# Altium schematic sheet HeartSound_LungSound.SchDoc
size A3; SheetNumber: 2; SheetTotal: 7
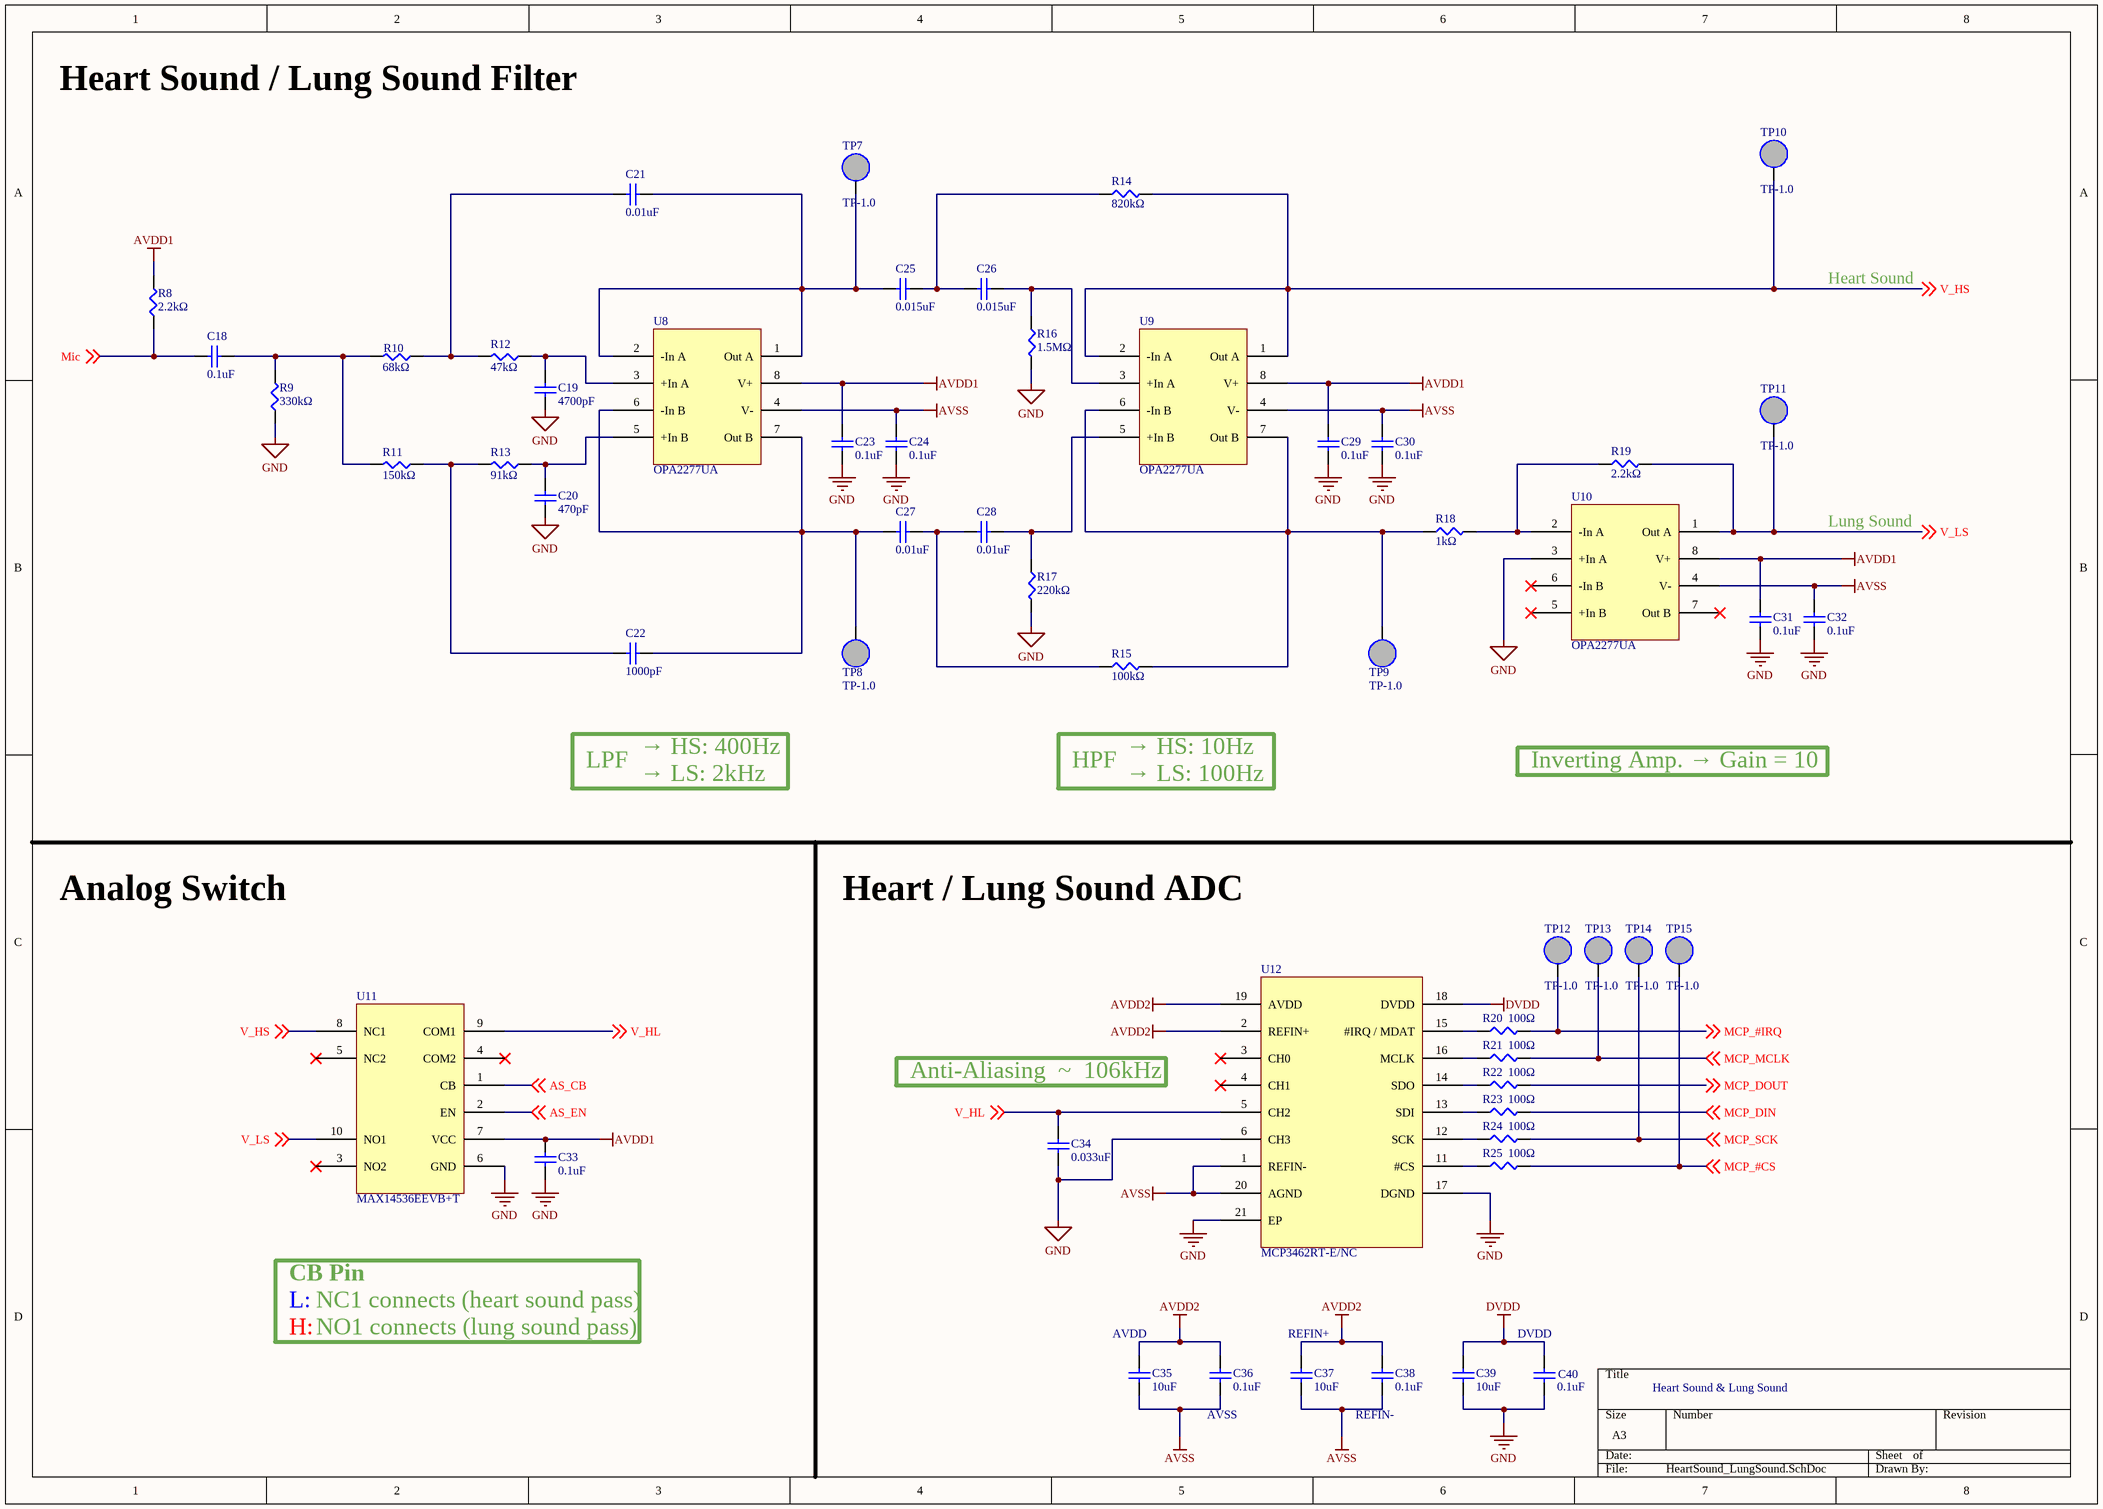
[diagram p0: HeartSound_LungSound.SchDoc]

## Parts
C18  0.1uF  [0402]
C19  4700pF  [0402]
C20  470pF  [0402]
C21  0.01uF  [0402]
C22  1000pF  [0402]
C23  0.1uF  [0402]
C24  0.1uF  [0402]
C25  0.015uF  [0402]
C26  0.015uF  [0402]
C27  0.01uF  [0402]
C28  0.01uF  [0402]
C29  0.1uF  [0402]
C30  0.1uF  [0402]
C31  0.1uF  [0402]
C32  0.1uF  [0402]
C33  0.1uF  [0402]
C34  0.033uF  [0402]
C35  10uF  [0603]
C36  0.1uF  [0402]
C37  10uF  [0603]
C38  0.1uF  [0402]
C39  10uF  [0603]
C40  0.1uF  [0402]
R8  2.2kΩ  [0402]
R9  330kΩ  [0402]
R10  68kΩ  [0402]
R11  150kΩ  [0402]
R12  47kΩ  [0402]
R13  91kΩ  [0402]
R14  820kΩ  [0402]
R15  100kΩ  [0402]
R16  1.5MΩ  [0402]
R17  220kΩ  [0402]
R18  1kΩ  [0402]
R19  2.2kΩ  [0402]
R20  100Ω  [0402]
R21  100Ω  [0402]
R22  100Ω  [0402]
R23  100Ω  [0402]
R24  100Ω  [0402]
R25  100Ω  [0402]
TP7  TP-1.0  [Testpoint]  (no BOM)
TP8  TP-1.0  [Testpoint]  (no BOM)
TP9  TP-1.0  [Testpoint]  (no BOM)
TP10  TP-1.0  [Testpoint]  (no BOM)
TP11  TP-1.0  [Testpoint]  (no BOM)
TP12  TP-1.0  [Testpoint]  (no BOM)
TP13  TP-1.0  [Testpoint]  (no BOM)
TP14  TP-1.0  [Testpoint]  (no BOM)
TP15  TP-1.0  [Testpoint]  (no BOM)
U8  OPA2277UA  [SOIC-8]
U9  OPA2277UA  [SOIC-8]
U10  OPA2277UA  [SOIC-8]
U11  MAX14536EEVB+T  [ULTRA-TQFN-10]
U12  MCP3462RT-E/NC  [UQFN-20]

## Nets
AVDD1: C23.1 C29.2 C31.2 C33.2 R8.2 U8.8(V+) U9.8(V+) U10.8(V+) U11.7(VCC)
AVDD2: C35.2 C36.2 C37.1 C38.2 U12.2(REFIN+) U12.19(AVDD)
AVSS: C24.2 C30.1 C32.1 C35.1 C36.1 C37.2 C38.1 U8.4(V-) U9.4(V-) U10.4(V-) U12.1(REFIN-) U12.20(AGND)
DVDD: C39.2 C40.2 U12.18(DVDD)
GND: C19.2 C20.2 C23.2 C24.1 C29.1 C30.2 C31.1 C32.2 C33.1 C34.2 C39.1 C40.1 R9.1 R16.2 R17.2 U10.3(+In_A) U11.6(GND) U12.6(CH3) U12.17(DGND) U12.21(EP)
AS_CB: U11.1(CB) ; off-sheet AS_CB
AS_EN: U11.2(EN) ; off-sheet AS_EN
MCP_#CS: R25.2 TP15.1 ; off-sheet MCP_#CS
MCP_#IRQ: R20.2 TP12.1 ; off-sheet MCP_#IRQ
MCP_DIN: R23.2 ; off-sheet MCP_DIN
MCP_DOUT: R22.2 ; off-sheet MCP_DOUT
MCP_MCLK: R21.2 TP13.1 ; off-sheet MCP_MCLK
MCP_SCK: R24.2 TP14.1 ; off-sheet MCP_SCK
Mic: C18.1 R8.1 ; off-sheet Mic
V_HL: C34.1 U11.9(COM1) U12.5(CH2) ; off-sheet V_HL
V_HS: R14.2 TP10.1 U9.1(Out_A) U9.2(-In_A) U11.8(NC1) ; off-sheet V_HS
V_LS: R19.2 TP11.1 U10.1(Out_A) U11.10(NO1) ; off-sheet V_LS
NetC18_2: C18.2 R9.2 R10.2 R11.2
NetC19_1: C19.1 R12.1 U8.3(+In_A)
NetC20_1: C20.1 R13.1 U8.5(+In_B)
NetC21_1: C21.1 C25.2 TP7.1 U8.1(Out_A) U8.2(-In_A)
NetC21_2: C21.2 R10.1 R12.2
NetC22_1: C22.1 R11.1 R13.2
NetC22_2: C22.2 C27.2 TP8.1 U8.6(-In_B) U8.7(Out_B)
NetC25_1: C25.1 C26.2 R14.1
NetC26_1: C26.1 R16.1 U9.3(+In_A)
NetC27_1: C27.1 C28.2 R15.1
NetC28_1: C28.1 R17.1 U9.5(+In_B)
NetR15_2: R15.2 R18.1 TP9.1 U9.6(-In_B) U9.7(Out_B)
NetR18_2: R18.2 R19.1 U10.2(-In_A)
NetR20_1: R20.1 U12.15(#IRQ_/_MDAT)
NetR21_1: R21.1 U12.16(MCLK)
NetR22_1: R22.1 U12.14(SDO)
NetR23_1: R23.1 U12.13(SDI)
NetR24_1: R24.1 U12.12(SCK)
NetR25_1: R25.1 U12.11(#CS)

Not connected (* = marked no-connect by the designer): U10 5(+In_B)* 6(-In_B)* 7(Out_B)*; U11 3(NO2)* 4(COM2)* 5(NC2)*; U12 3(CH0)* 4(CH1)*

## Notes on the sheet
- Heart Sound / Lung Sound Filter
- Heart Sound
- Lung Sound
- LPF
- → LS: 2kHz
- → HS: 400Hz
- HPF
- → LS: 100Hz
- → HS: 10Hz
- Inverting Amp. → Gain = 10
- Analog Switch
- Heart / Lung Sound ADC
- Anti-Aliasing  ~  106kHz
- CB Pin
- L:
- NC1 connects (heart sound pass)
- H:
- NO1 connects (lung sound pass)
- (near C35) AVDD
- (near C37) REFIN+
- (near C40) DVDD
- Heart Sound & Lung Sound
- (near C36) AVSS
- (near C38) REFIN-

## Library data of the parts
C18-C34 C36 C38 C40 = 0402: MLCC-0402
C35 C37 C39 = 0603: MLCC-0603
R8-R25 = 0402: Resistor_SMD_0402; AuthorBy: yjlab
TP7-TP15 = Testpoint
U8-U10 = OPA2277UA: High Precision OP Amp, 2 Channel
U11 = MAX14536EEVB+T: Analog Switch, 0.135 (Ω) On-Resistence
U12 = MCP3462RT-E/NC: Delta-to-Sigma ADC, 16 Bit, 2 Channel